# Altium schematic sheet ACE.SchDoc
size A4
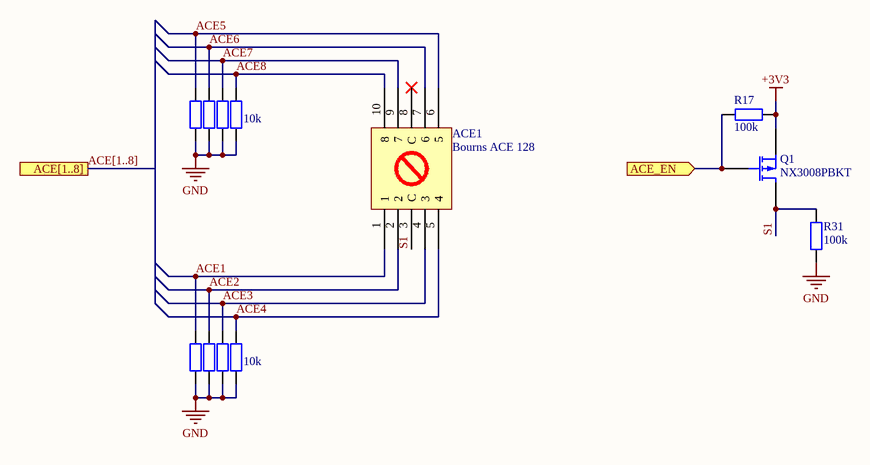
[diagram p0: ACE.SchDoc]

## Parts
ACE1  Bourns ACE 128  [Bourns ACE 128]
Q1  NX3008PBKT  [SOT95P230X110-3L]
R17  100k  [R1005_0402i_L]
R18  10k  [R1005_0402i_L]  (value not drawn)
R19  10k  [R1005_0402i_L]  (value not drawn)
R20  10k  [R1005_0402i_L]  (value not drawn)
R21  10k  [R1005_0402i_L]
R22  10k  [R1005_0402i_L]  (value not drawn)
R23  10k  [R1005_0402i_L]  (value not drawn)
R24  10k  [R1005_0402i_L]  (value not drawn)
R25  10k  [R1005_0402i_L]
R31  100k  [R1005_0402i_L]

## Ports
ACE[1..8], ACE_EN (in)

## Nets
+3V3: Q1.2(S) R17.2
GND: R18.1 R19.1 R20.1 R21.1 R22.1 R23.1 R24.1 R25.1 R31.1
ACE1: ACE1.1 R22.2
ACE2: ACE1.2 R23.2
ACE3: ACE1.4(3) R24.2
ACE4: ACE1.5(4) R25.2
ACE5: ACE1.6(5) R18.2
ACE6: ACE1.7(6) R19.2
ACE7: ACE1.9(7) R20.2
ACE8: ACE1.10(8) R21.2
ACE_EN: Q1.1(G) R17.1 ; port ACE_EN
S1: ACE1.3(C) Q1.3(D) R31.2

Not connected (* = marked no-connect by the designer): ACE1 8(C)*

## Buses and harness runs
bus ACE[1..8] = port ACE[1..8]

## Library data of the parts
Q1 = MOSFET-P: P-Channel MOSFET; Published: 8-Jun-2000; LatestRevisionDate: 17-Jul-2002; LatestRevisionNote: Re-released for DXP Platform.; PackageVersion: 1995/1996; PackageReference: E3; Publisher: Altium Limited; PackageDescription: TO, Flat Index; 3 In-Line, Axial Leads; Body Dia. 4.6mm; Lead Dia. 0.5 mm (max)
R17-R25 R31 = R